# EAGLE design 5d (EAGLE 6.4)
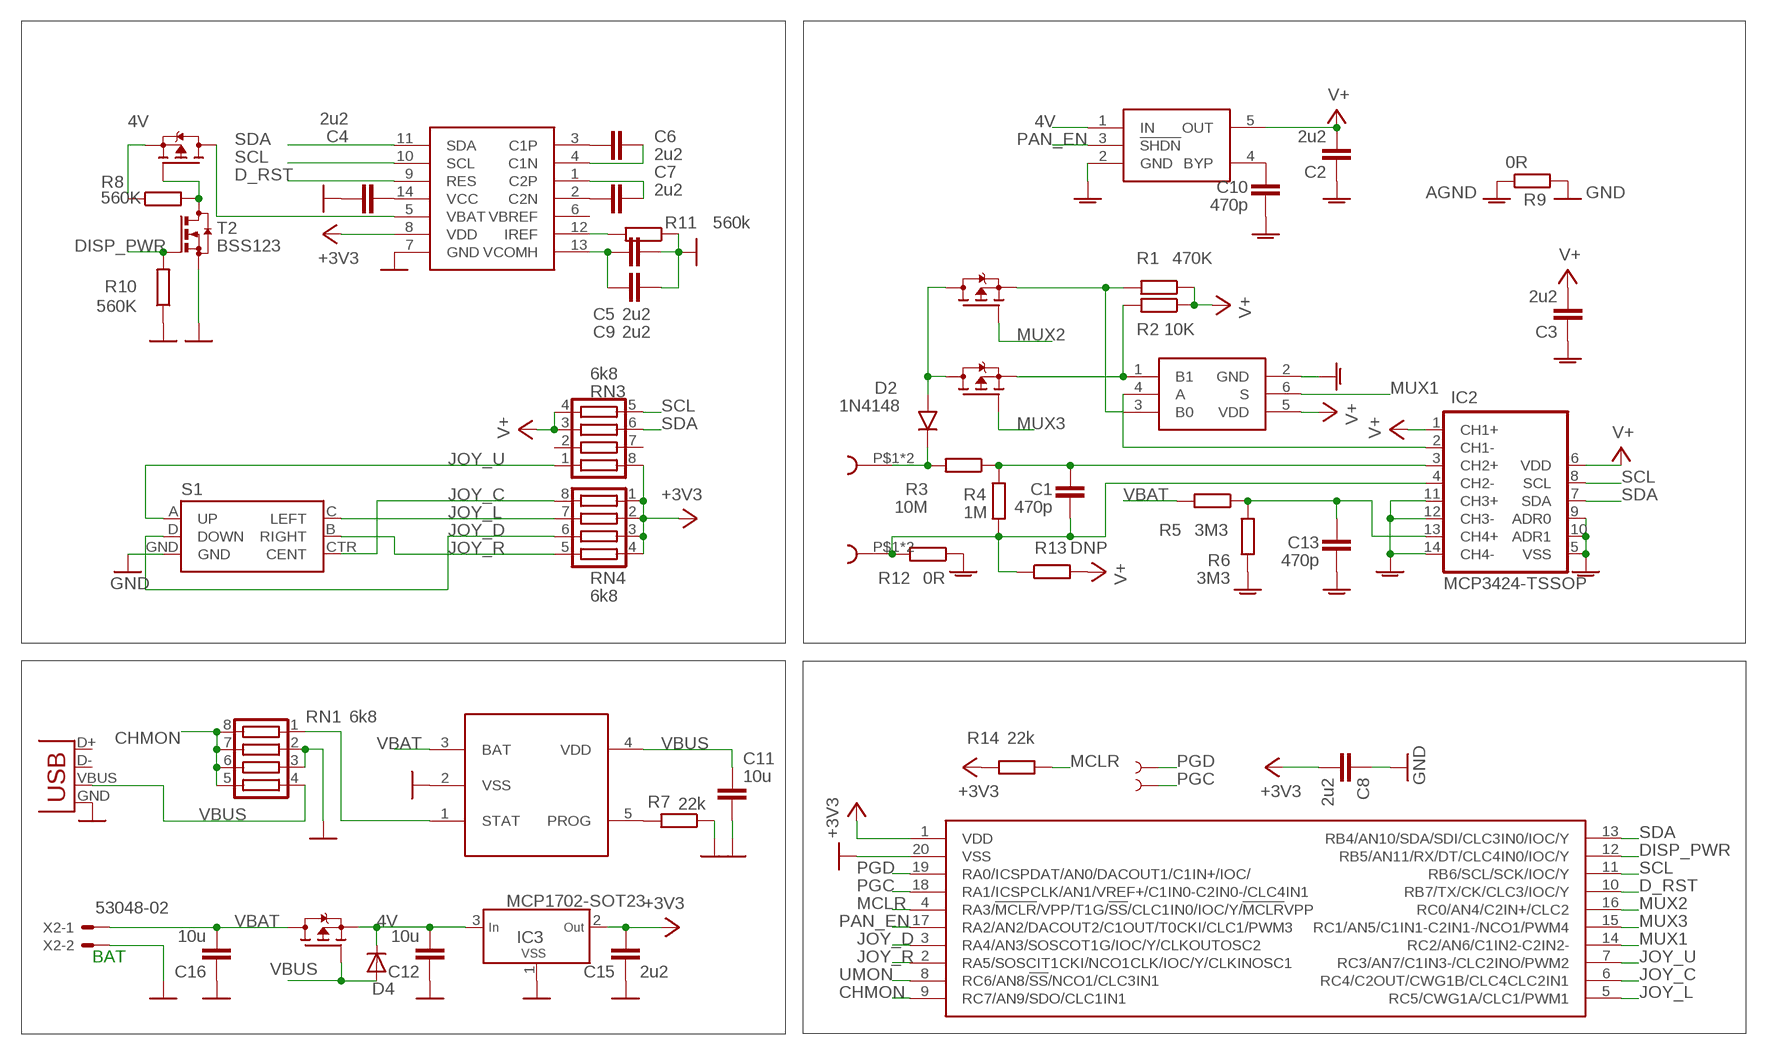
[diagram p0: schematic, sheet 1]

## Parts
C1  470p  C_0603  [0603]
C2  2u2  C_0603  [0603]
C3  2u2  C_0603  [0603]
C4  2u2  C_0603  [0603]
C5  2u2  C_0603  [0603]
C6  2u2  C_0603  [0603]
C7  2u2  C_0603  [0603]
C8  2u2  C_0603  [0603]
C9  2u2  C_0603  [0603]
C10  470p  C_0603  [0603]
C11  10u  C_0806  [R0805]
C12  10u  C_0806  [R0805]
C13  470p  C_0603  [0603]
C15  2u2  C_0603  [0603]
C16  10u  C_0806  [R0805]
D1  DISP_OLED_049B  [DISP_OLED_049_B]
D2  1N4148  1N4148SOD  [SOD-80]
D4  DIODE-SOD123  [SOD123]
IC2  MCP3424-TSSOP  [TSSOP14]
IC3  MCP1702-SOT23  [SOT23]
IC5  NC7SB3157  [SC70-6]
R1  470K  R_0805  [R0805]
R2  10K  R_0805  [R0805]
R3  10M  R_0805  [R0805]
R4  1M  R_0805  [R0805]
R5  3M3  R_0603  [0603]
R6  3M3  R_0603  [0603]
R7  22k  R_0603  [0603]
R8  560K  R_0603  [0603]
R9  0R  R_0603  [0603]
R10  560K  R_0603  [0603]
R11  560k  R_0603  [0603]
R12  0R  R_0603  [0603]
R13  DNP  R_0603  [0603]
R14  22k  R_0603  [0603]
RN1  6k8  CTS742C083  [CTS742C083]
RN3  6k8  CTS742C083  [CTS742C083]
RN4  6k8  CTS742C083  [CTS742C083]
S1  JOYSTICK_MINI  [JOYSTICK_MINI]
T1  BSS84  [SOT23-3]
T2  BSS123  [SOT23]
T3  BSS84  [SOT23-3]
T4  BSS84  [SOT23-3]
T5  BSS84  [SOT23-3]
TP1  TEST-POINT3X5  [PAD.03X.05]
TP2  TEST-POINT3X5  [PAD.03X.05]
U$1  BANPLUG_2  [BANPLUG_2]
U$2  BANPLUG_2  [BANPLUG_2]
U$3  TC1015  [SOT23-5]
U$4  MCP73831  [SOT23-5]
U$6  PIC16F1508SSOP20  [SSOP20]
X1  USB-MICROB  [USB-MICROB]
X2  53048-02  [53048-02]

## Nets
4V: C12.2 D4.C IC3.3(IN) R8.1 T1.2(S) T3.2(S) U$3.1(IN)
+3V3: C8.2 C15.2 D1.8(VDD) IC3.2(OUT) R14.2 RN3.8 RN4.1 RN4.2 RN4.3 RN4.4 U$6.1(VDD)
AGND: C2.1 C3.1 C10.1 C13.1 IC2.5(VSS) IC2.9(ADR0) IC2.10(ADR1) IC2.11(CH3+) IC2.12(CH3-) IC2.14(CH4-) IC5.2(GND) R6.2 R9.1 R12.1 U$3.2(GND)
CHMON: RN1.5 RN1.6 RN1.7 RN1.8 U$6.9(RC7/AN9/SDO/CLC1IN1)
D_RST: D1.9(RES) U$6.10(RB7/TX/CK/CLC3/IOC/Y)
DISP_PWR: R10.2 T2.1(G) U$6.12(RB5/AN11/RX/DT/CLC4IN0/IOC/Y)
GND: C4.1 C5.2 C8.1 C9.2 C11.2 C12.1 C15.1 C16.1 D1.7(GND) IC3.1(VSS) R7.1 R9.2 R10.1 R11.1 RN1.2 RN1.3 S1.GND T2.2(S) U$4.2(VSS) U$6.20(VSS) X1.GND X2.2
JOY_C: RN4.8 S1.CTR(CENT) U$6.6(RC4/C2OUT/CWG1B/CLC4CLC2IN1)
JOY_D: RN4.6 S1.D(DOWN) U$6.3(RA4/AN3/SOSCOT1G/IOC/Y/CLKOUTOSC2)
JOY_L: RN4.7 S1.C(LEFT) U$6.5(RC5/CWG1A/CLC1/PWM1)
JOY_R: RN4.5 S1.B(RIGHT) U$6.2(RA5/SOSCIT1CKI/NCO1CLK/IOC/Y/CLKINOSC1)
JOY_U: RN3.1 S1.A(UP) U$6.7(RC3/AN7/C1IN3-/CLC2INO/PWM2)
MCLR: R14.1 U$6.4(RA3/!MCLR!/VPP/T1G/!SS!/CLC1IN0/IOC/Y/!MCLR!VPP)
MUX1: IC5.6(S) U$6.14(RC2/AN6/C1IN2-C2IN2-)
MUX2: T4.1(G) U$6.16(RC0/AN4/C2IN+/CLC2)
MUX3: T5.1(G) U$6.15(RC1/AN5/C1IN1-C2IN1-/NCO1/PWM4)
N$1: C10.2 U$3.4(BYP)
N$2: IC5.1(B1) R2.2 T5.2(S)
N$3: IC5.3(B0) R1.2 T4.2(S)
N$4: C13.2 IC2.13(CH4+) R5.1 R6.1
N$5: IC2.2(CH1-) IC5.4(A)
N$6: D2.K R3.2 U$1.P$1 U$1.P$2
N$7: R8.2 T2.3(D) T3.1(G)
N$8: C1.2 IC2.3(CH2+) R3.1 R4.1
N$9: RN1.1 U$4.1(STAT)
N$10: C1.1 IC2.4(CH2-) R4.2 R12.2 R13.1 U$2.P$1 U$2.P$2
N$11: C4.2 D1.14(VCC)
N$12: D1.5(VBAT) T3.3(D)
N$13: C5.1 C9.1 D1.13(VCOMH)
N$14: D1.12(IREF) R11.2
N$15: D2.A T4.3(D) T5.3(D)
N$18: C6.1 D1.3(C1P)
N$19: C7.1 D1.2(C2N)
N$20: C7.2 D1.1(C2P)
N$21: C6.2 D1.4(C1N)
N$78: R7.2 U$4.5(PROG)
PAN_EN: U$3.3(!SHDN) U$6.17(RA2/AN2/DACOUT2/C1OUT/T0CKI/CLC1/PWM3)
PGC: TP2.P$1 U$6.18(RA1/ICSPCLK/AN1/VREF+/C1IN0-C2IN0-/CLC4IN1)
PGD: TP1.P$1 U$6.19(RA0/ICSPDAT/AN0/DACOUT1/C1IN+/IOC/)
SCL: D1.10(SCL) IC2.8(SCL) RN3.5 U$6.11(RB6/SCL/SCK/IOC/Y)
SDA: D1.11(SDA) IC2.7(SDA) RN3.6 U$6.13(RB4/AN10/SDA/SDI/CLC3IN0/IOC/Y)
UMON: U$6.8(RC6/AN8/!SS!/NCO1/CLC3IN1)
V+: C2.2 C3.2 IC2.1(CH1+) IC2.6(VDD) IC5.5(VDD) R1.1 R2.1 R13.2 RN3.3 RN3.4 U$3.5(OUT)
VBAT: C16.2 R5.2 T1.3(D) U$4.3(BAT) X2.1
VBUS: C11.1 D4.A RN1.4 T1.1(G) U$4.4(VDD) X1.VBUS
Unconnected: D1.6(VBREF) RN3.2 RN3.7 X1.D+ X1.D-

## Notes on the sheet
- BAT

## Library data of the parts
C1-C13 C15 C16 = _moja:C
D1 = _moja:DISP_OLED_049
D2 = _mcom5:1N4148
D4 = diode:DIODE-: DIODE
IC2 = _mcom5:MCP3424
IC3 = _mcom4:MCP1702
IC5 = _mcom5:NC7SB3157
R1-R14 = _moja:R
RN1 RN3 RN4 = resistor-net:CTS742C083: Chip Resistor Array 4 Single Resistor Source: http://www.ctscorp.com/components/Datasheets/CTSChipArrayDs.pdf
S1 = SparkFun-Electromechanical:JOYSTICK_MINI: Small 5-way tactile joystick, COM-10063 4UCON SF303GJ26
T1 T3-T5 = _moja:BSS84
T2 = transistor-small-signal:BSS123: N-CHANNEL MOS FET
TP1 TP2 = SparkFun:TEST-POINT
U$1 U$2 = _moja:BANPLUG_2
U$3 = _moja:TC1015
U$4 = _moja:MCP73831
U$6 = _mcom5:PIC16F1508
X1 = SparkFun:USB: USB Connectors USB-B-PTH is fully proven SKU : PRT-00139 USB-miniB is fully proven SKU : PRT-00587 USB-A-PCB is untested. USB-A-H is throughly reviewed, but untested. Spark Fun Electronics SKU : PRT-00437 USB-B-SMT is throughly reviewed, but untested. Needs silkscreen touching up. USB-A-S has not been used/tested USB-MB-H has not been used/tested
X2 = con-molex:53?-02: CONNECTOR wire to board 1.25 mm (.049 inch) pitch header

## Board
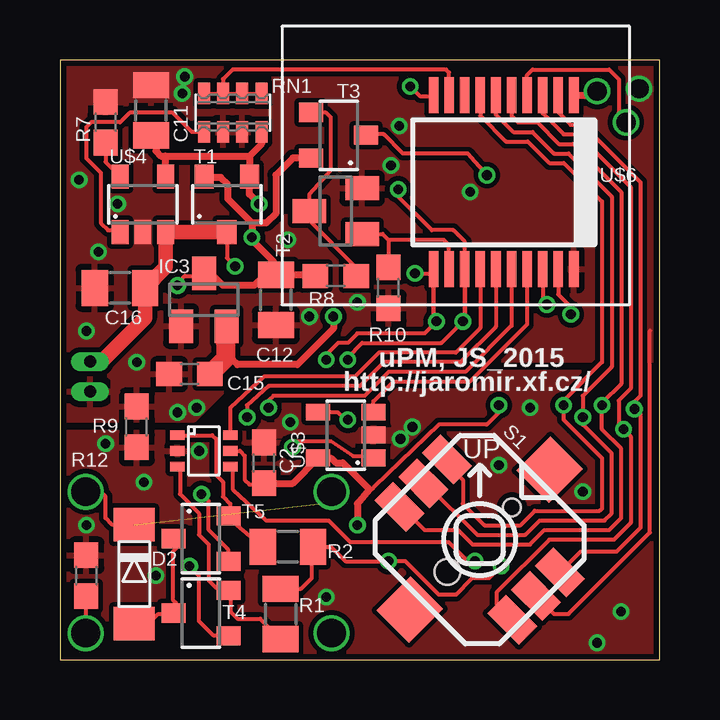
[diagram p1: board, top side]
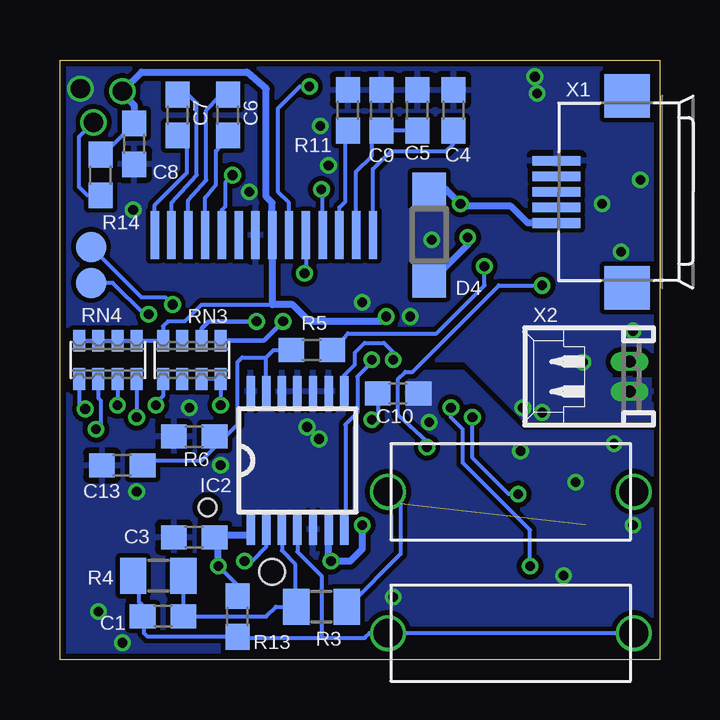
[diagram p2: board, bottom side, seen from below]

Size 25 x 25 mm. Coordinates in mm from the lower left corner, seen from the top.
Outline: 0,0 25,0 25,25 0,25 0,0
Copper layers (1*16): Top 0.035mm / dielectric 1.5mm / Bottom 0.035mm
Design rules "ch_6": minimum track width 0.15mm, minimum drill 0.4mm, track to track 0.2mm, track to pad 0.2mm, pad to pad 0.2mm, via to via 0.2mm, smd to smd 0.2mm, copper to edge 10mil, drill to drill 8mil, minimum pad ring 0.15mm, minimum via ring 0.15mm, stop-mask expansion 4mil, vias tented up to drill 0mil, thermal gap 10mil

### Footprints (pad centres in the part's own frame; a part is rotated, then mirrored left to right if it is on the bottom)
0603 = smd 1.067 x 1: 1 -0.85,0; 2 0.85,0
R0805 = smd 1.1 x 1.5: 1 -1.05,0; 2 1.05,0
DISP_OLED_049_B = smd 0.35 x 2 bottom: 1 4.55,-2.9; 2 3.85,-2.9; 3 3.15,-2.9; 4 2.45,-2.9; 5 1.75,-2.9; 6 1.05,-2.9; 7 0.35,-2.9; 8 -0.35,-2.9; 9 -1.05,-2.9; 10 -1.75,-2.9; 11 -2.45,-2.9; 12 -3.15,-2.9; 13 -3.85,-2.9; 14 -4.55,-2.9
SOD-80 = smd 1.397 x 1.702: A 1.905,0; K -2.223,0
SOD123 = smd 1.4 x 1.4: A 1.9,0; C -1.9,0
TSSOP14 = smd 1.3 x 0.35: 1 -2.875,1.95; 2 -2.875,1.3; 3 -2.875,0.65; 4 -2.875,0; 5 -2.875,-0.65; 6 -2.875,-1.3; 7 -2.875,-1.95; 8 2.875,-1.95; 9 2.875,-1.3; 10 2.875,-0.65; 11 2.875,0; 12 2.875,0.65; 13 2.875,1.3; 14 2.875,1.95
SOT23 = smd 1 x 1.4: 1 -0.95,-1.1; 2 0.95,-1.1; 3 0,1.1
SC70-6 = smd 0.4 x 0.6: 1 -0.65,-1.1; 2 0,-1.1; 3 0.65,-1.1; 4 0.65,1.1; 5 0,1.1; 6 -0.65,1.1
CTS742C083 = smd 0.5 x 0.9: 1 -1.2,-0.8; 2 -0.4,-0.8; 3 0.4,-0.8; 4 1.2,-0.8; 5 1.2,0.8; 6 0.4,0.8; 7 -0.4,0.8; 8 -1.2,0.8
JOYSTICK_MINI = smd 1.85 x 1.1: A -3.325,1.4; B 3.325,1.4; C -3.325,-1.4; CTR -3.325,0; D 3.325,-1.4; GND 3.325,0 | smd 1.9 x 2: NC 0,4.13; NC@0 0,-4.13 | hole 0.75: 0,1.9 | hole 1.05: 0,-1.9
SOT23-3 = smd 0.8 x 1: 1 0.91,1.13; 2 -0.99,1.13; 3 -0.04,-1.17
PAD.03X.05 = smd 1.27 x 1.27: P$1 0,0
BANPLUG_2 = drill 1.2: P$1 -5.125,0; P$2 5.125,0
SOT23-5 = smd 0.7 x 1: 1 -0.99,-1.17; 2 -0.04,-1.17; 3 0.91,-1.17; 4 0.91,1.13; 5 -0.99,1.13
SSOP20 = smd 0.4 x 1.5: 1 -2.925,-3.625; 2 -2.275,-3.625; 3 -1.625,-3.625; 4 -0.975,-3.625; 5 -0.325,-3.625; 6 0.325,-3.625; 7 0.975,-3.625; 8 1.625,-3.625; 9 2.275,-3.625; 10 2.925,-3.625; 11 2.925,3.625; 12 2.275,3.625; 13 1.625,3.625; 14 0.975,3.625; 15 0.325,3.625; 16 -0.325,3.625; 17 -0.975,3.625; 18 -1.625,3.625; 19 -2.275,3.625; 20 -2.925,3.625
USB-MICROB = smd 0.4 x 2: D+ 0,3.1; D- -0.65,3.1; GND 1.3,3.1; ID 0.65,3.1; VBUS -1.3,3.1 | smd 1.8 x 1.9: GND@2 -4,0.15; GND@3 4,0.15
53048-02 = drill 0.5 pad 0.698 long: 1 0.625,-1.25; 2 -0.625,-1.25

### Placement (x,y rotation side)
C1  20.7,1.8 0 bottom
C2  8.5,8.2 270 top
C3  19.4,5.1 0 bottom
C4  8.6,22.9 270 bottom
C5  10.1,22.9 90 bottom
C6  18,22.7 270 bottom
C7  20.1,22.7 270 bottom
C8  21.9,21.5 90 bottom
C9  11.6,22.9 90 bottom
C10  10.9,11.1 180 bottom
C11  3.8,22.9 90 top
C12  9,15 90 top
C13  22.4,8.1 0 bottom
C15  5.4,11.9 0 top
C16  2.5,15.5 0 top
D1  16.5,20.6 0 top
D2  3.1,3.4 270 top
D4  9.6,17.7 90 bottom
IC2  15.1,8.3 90 bottom
IC3  6,15 0 top
IC5  6,8.7 270 top
R1  9.2,1.9 270 top
R2  9.5,4.7 180 top
R3  14.1,2.2 0 bottom
R4  20.9,3.5 180 bottom
R5  14.5,12.9 0 bottom
R6  19.4,9.3 180 bottom
R7  1.9,22.4 270 top
R8  11.5,16 0 top
R9  3.2,9.7 90 top
R10  13.7,15.5 90 top
R11  13,22.9 270 bottom
R12  1.1,3.5 270 top
R13  17.6,1.8 90 bottom
R14  23.3,20.2 90 bottom
RN1  7.2,22.8 0 top
RN3  19.5,12.5 0 bottom
RN4  23,12.5 180 bottom
S1  17.5,5 315 top
T1  7,19 0 top
T2  11.5,18.7 90 top
T3  11.6,21.9 90 top
T4  5.9,1.9 270 top
T5  5.9,5 270 top
TP1  23.7,15.7 0 bottom
TP2  23.7,17.2 0 bottom
U$1  6.2,7 180 bottom
U$2  6.2,1.1 0 bottom
U$3  11.9,9.4 90 top
U$4  3.5,19 0 top
U$6  18.5,19.9 180 top
X1  1.2,19.5 90 bottom
X2  2.5,11.8 90 bottom

### Tracks (layer width: path | path; a pad name or v marks a point on that pad's centre or on a via)
4V  (via drill 0.4)
  Top 0.16: U$3.1 12.87,8.47 12.23,8.47 11.3,9.1 9.9,9.1 v9.7,8.85 | v4.9,15.6 4.9,15.7 5.2,16 5.9,16 IC3.3
  Top 0.3: 8,18.2 v8,17.6 8,17.5 8.9,16.6 8.9,16.15 C12.2 | IC3.3 6.1,16 6.4,16 6.8,15.6 8.1,15.6 8.5,16 8.95,16 C12.2 | C12.2 10.2,16.05 R8.1 | T3.2 9.71,20.91 9,20.2 9,18.6 8.6,18.2 8,18.2 | 8,18.2 7,19.2 7,19.8 6.7,20.1 6.04,20.1 T1.2
  Bottom 0.16: v9.7,8.85 9.7,9.1 10.9,10.2 10.9,11.7 10.6,12 10.3,12 6.7,15.6 v4.9,15.6
  Bottom 0.3: D4.C 9.5,15.8 8,17.3 v8,17.6
+3V3  (via drill 0.4, 0.8)
  Top 0.3: 6.95,13.8 IC3.2 | U$6.1 22.23,23.52 v22.4,23.7 | v11.4,14.3 11.4,13.8 9.9,12.3 7.4,12.3 7.2,12.5 7.05,12.7 6.9,12.55
  Top 0.8: 6.95,13.8 6.95,13.45 6.9,13.2 6.9,12.55 C15.2
  Bottom 0.16: RN4.4 RN4.3 RN4.2 RN4.1 RN3.8 20.7,13.9 20.5,14.1 19.8,14.1 19.1,14.8 16.15,14.8 | R14.2 23.2,21.05 C8.2
  Bottom 0.3: v11.4,14.3 11.6,14.1 14.6,14.1 15.3,14.8 16.15,14.8 D1.8 16.15,19.05 16.4,19.3 16.4,23.8 17.2,24.5 21.6,24.5 v22.4,23.7 21.9,23.1 C8.2
AGND  (via drill 0.4)
  other vias: 14.2,9.2 22.4,0.7 21.8,7 1.9,9 23.4,2 5.8,8.7 9.6,9.9 14.7,9.7 18.3,8.1 19.6,10.5 1.1,5.6 4,3.5 11.1,2.6 3.5,7.4
  pour Top: 0,0 25,0 25,12 9,12 6.5,9.5 0,9.5
  pour Bottom: 0,0 25,0 25,12 8.2,12 5.7,9.5 0,9.5
  pour Top (no thermals): 8.4,9.8 8.1,9.3 9.2,9.3 9.4,9.5 9.4,9.8
  pour Bottom (no thermals): 10.4,10.2 10.5,10.3 10.5,12 9.2,12 9.2,10.2
  pour Top (no thermals): 12.5,9.6 12.1,9.1 13.9,9.1 13.9,9.6
CHMON
  Top 0.16: RN1.7 6.8,24.2 7.2,24.6 16.1,24.6 16.23,24.48 U$6.9 | RN1.8 RN1.7 | RN1.7 RN1.6 RN1.5
D_RST  (via drill 0.4)
  Top 0.16: v14.6,23.9 15,23.5 15.55,23.5 U$6.10
  Bottom 0.16: v14.6,23.9 15,23.9 15.9,23 15.9,19.5 15.45,19.05 D1.9
DISP_PWR
  Top 0.16: U$6.12 16.23,17.27 16,17.5 13.7,17.5 | 13.7,17.5 R10.2 | T2.1 13.45,17.75 13.7,17.5
GND  (via drill 0.4, 0.8)
  Top 0.16: S1.GND 19.95,2.65 19.95,2.55 20.6,1.9 21.2,1.9 24.6,5.3 24.6,13.7
  other vias: 5.7,10.5 1.6,17 24.15,23.8 9.5,17.5 10.4,14.3 0.8,20 13.8,20.6 5.2,24.3 1.1,13.7 3.2,12.4 4.9,10.3 14.15,22.25 5.1,23.6 2.4,19 21.95,18.75 17.1,19.5 12.4,14.9
  pour Top: 0,10 5.6,10 8.1,12.5 25,12.5 25,25 0,25
  pour Bottom: 0,10 5.6,10 8.1,12.5 25,12.5 25,25 0,25
  pour Bottom (no thermals): 0.4,10.5 2.4,10.5 2.4,11.7 0.4,11.7
  pour Top (no thermals): 1,23.3 5.1,23.3 5.1,24.7 1,24.7
  pour Top (no thermals): 4.4,16.8 4.4,18.8 1.8,18.8 1.8,16.8
  pour Top (no thermals): 2.3,11.8 2.3,10.6 2.2,10.6 2.2,11.1 1.8,11.1 1.8,11.2 2.2,11.2 2.2,11.8
JOY_C  (via drill 0.4)
  Top 0.16: U$6.6 18.18,22.73 18.9,22 19.7,22 20.6,21.1 21.2,21.1 23,19.3 23,12.2 21.8,11 v21.8,10.1 21.8,9.8 23,8.6 23,6.1 22.7,5.8 20,5.8 19.4,5.2 17.4,5.2 15.25,7.35 S1.CTR
  Bottom 0.16: RN4.8 v21.8,10.1
JOY_D  (via drill 0.4)
  Top 0.16: S1.D 18.2,2.32 18.2,2.8 20.4,5 23.1,5 23.8,5.7 23.8,9.3 v23.5,9.6 23.3,9.8 23.3,10.8 23.8,11.3 23.8,19.7 21.6,21.9 21,21.9 20.12,22.77 U$6.3
  Bottom 0.16: RN4.6 23.4,10.9 23.3,10.8 23.3,9.8 v23.5,9.6
JOY_L  (via drill 0.4)
  Top 0.16: U$6.5 18.82,22.68 19.1,22.4 19.9,22.4 20.8,21.5 21.4,21.5 23.4,19.5 23.4,11.5 22.6,10.7 v22.6,10.6 22.6,9.6 23.4,8.8 23.4,5.9 22.9,5.4 20.2,5.4 19.6,4.8 17.2,4.8 16.6,5.4 15.2,5.4 14.34,6.26 14.34,6.36 S1.C
  Bottom 0.16: RN4.7 v22.6,10.6
JOY_R  (via drill 0.4)
  Top 0.16: U$6.2 20.77,22.82 21.3,22.3 21.8,22.3 24.2,19.9 24.2,11 23.9,10.7 23.9,10.5 v23.95,10.45 24.2,10.2 24.2,5.5 23.2,4.5 21.7,4.5 S1.B
  Bottom 0.16: RN4.5 24.2,10.4 v23.95,10.45
JOY_U  (via drill 0.4)
  Top 0.16: U$6.7 17.52,22.68 18.6,21.6 19.5,21.6 20.4,20.7 21,20.7 22.6,19.1 22.6,12.4 21,10.8 v21,10.6 21,10 22.6,8.4 22.6,6.3 22.5,6.2 19.8,6.2 19.2,5.6 17.7,5.6 16.8,6.5 16.8,7.5 16.14,8.16 S1.A
  Bottom 0.16: RN3.1 20.7,11 21,10.7 v21,10.6
MCLR  (via drill 0.8)
  Top 0.16: U$6.4 19.48,24.38 19.7,24.6 22.9,24.6 23.3,24.2 23.3,22.8 v23.6,22.4
  Bottom 0.16: R14.1 23.85,19.35 24.2,19.7 24.2,21.8 v23.6,22.4
MUX1
  Top 0.16: U$6.14 17.52,13.82 16.5,12.8 13.3,12.8 12.3,11.8 8.5,11.8 7.1,10.5 IC5.6
MUX2  (via drill 0.4)
  Top 0.16: U$6.16 18.82,13.93 16.9,12 13.7,12 12.7,11 8.9,11 8.7,10.8 v8.7,10.5 | T4.1 6.41,0.99 5.8,1.6 5.8,3.5 v5.4,3.9
  Bottom 0.16: v8.7,10.5 8.7,10.1 8.2,9.6 8.2,8.2 5.4,5.4 v5.4,3.9
MUX3  (via drill 0.4)
  Top 0.16: U$6.15 18.18,13.88 16.7,12.4 13.5,12.4 12.5,11.4 8.7,11.4 7.8,10.6 v7.8,10.1 | T5.1 7.03,4.57 6.2,5.4 6.2,6.6 v5.9,6.9
  Bottom 0.16: v7.8,10.1 7.8,8.4 6.3,6.9 v5.9,6.9
N$1  (via drill 0.4)
  Top 0.16: v12,10 11.9,10 11.6,10.3 U$3.4
  Bottom 0.16: C10.2 11.75,10.25 v12,10
N$2
  Top 0.16: IC5.1 6.35,9.35 6.5,9.2 6.5,7.7 6.8,7.4 6.8,6.8 7.1,6.5 7.1,6.02 | 7.1,6.02 T5.2 | 7.1,6.02 7.1,5.85 R2.2
N$3
  Top 0.16: IC5.3 5,7.95 5,6.9 5.8,6.1 5.8,5.2 6.2,4.8 6.2,3.3 6.5,3 7.02,3 T4.2 7.12,2.9 7.12,1.98 7.4,1.7 8.35,1.7 R1.2
N$4
  Bottom 0.16: IC2.13 16.4,12.6 | 16.4,12.6 16.1,12.9 R5.1 | 16.4,12.6 17.4,12.6 17.6,12.4 17.6,9.8 18.15,9.25 R6.1 18.4,9.25 18.4,9 19.1,8.3 21.4,8.3 C13.2
N$5  (via drill 0.4)
  Top 0.16: v17.3,4.1 17,4.1 16.2,4.9 12.1,4.9 11.2,5.8 8.6,5.8 7.2,7.1 7.2,8 7.15,8.05 IC5.4
  Bottom 0.16: IC2.2 16.4,4.7 17,4.1 v17.3,4.1
N$6  (1 unrouted)
  Top 0.16: D2.K 2.18,5.62 1.9,5.9 1.9,6.8 1.7,7 U$1.P$1
  Bottom 0.16: U$1.P$2 11.3,7 10.8,6.5 10.8,4.4 13,2.2 13,2.25 R3.2
N$7
  Top 0.16: R8.2 12.35,16.35 10.4,18.3 T2.3 10.4,19.4 11.3,20.4 11.3,22.6 11.1,22.8 T3.1
N$8
  Bottom 0.16: IC2.3 15.75,4.55 15.2,4 15.2,2.25 R3.1 | 19.5,3.2 19.6,3.3 R4.1 C1.2 16.4,1.8 16,2.2 R3.1 | 15.1,2.15 R3.1
N$9
  Top 0.16: RN1.1 5.5,22 4.7,22.8 2.9,22.8 2.5,22.4 1.3,22.4 1.1,22.2 1.1,20.9 1.7,20.3 1.7,18.2 2,17.9 2.3,17.9 U$4.1
N$10
  Top 0.16: R12.2 1.07,2.65 U$2.P$2
  Bottom 0.16: IC2.4 15.1,4.5 14.1,3.5 14.1,0.9 | 14.1,0.9 12.3,0.9 12.1,1.1 U$2.P$1 U$2.P$2 | R4.2 21.7,3.25 21.7,2.4 21.35,2.05 C1.1 21.5,1.75 21.5,1.1 21.35,0.95 R13.1 17.25,0.95 17.2,0.9 14.1,0.9
N$11
  Bottom 0.16: D1.14 11.95,20.45 11.2,21.2 8.9,21.2 8.6,21.5 C4.2
N$12  (via drill 0.4)
  Top 0.16: v17.8,20.2 17,21.1 14.3,21.1 13.5,21.9 12.81,21.9 T3.3
  Bottom 0.16: D1.5 18.25,18.75 18.1,18.9 18.1,19.9 v17.8,20.2
N$13
  Bottom 0.16: D1.13 12.65,20.35 12,21 12,21.65 C9.1 C5.1
N$14
  Bottom 0.16: D1.12 13.35,18.85 13.1,19.1 13.1,21.6 13,21.7 R11.2
N$15
  Top 0.16: T5.3 4.83,4.63 4.7,4.5 4.7,2.5 4.83,2.37 T4.3 4.79,1.9 4.1,1.9 3.69,1.5 D2.A
N$18
  Bottom 0.16: D1.3 19.65,19.15 18.9,20 18.9,22.9 18.35,23.5 C6.1
N$19
  Bottom 0.16: D1.2 20.35,19.05 19.3,20.2 19.3,23.2 19.6,23.5 20.15,23.5 C7.1
N$20
  Bottom 0.16: D1.1 21.05,18.95 19.7,20.3 19.7,21.3 20.1,21.7 C7.2
N$21
  Bottom 0.16: D1.4 18.95,19.25 18.5,19.8 18.5,21.2 18.3,21.4 C6.2
N$78
  Top 0.16: R7.2 1.9,20.74 U$4.5
PAN_EN
  Top 0.16: U$3.3 13.07,10.77 13.9,11.6 17.1,11.6 19.48,13.97 U$6.17
PGC  (via drill 0.4)
  Top 0.16: U$6.18 20.12,14.93 v20.3,14.8
  Bottom 0.16: v20.3,14.8 20.6,15.1 21.6,15.1 TP2.P$1
PGD  (via drill 0.4)
  Top 0.16: U$6.19 20.77,15.22 21.3,14.7 v21.3,14.4
  Bottom 0.16: v21.3,14.4 21.5,14.4 22.8,15.7 TP1.P$1
SCL  (via drill 0.4)
  Top 0.16: 15.57,14.12 15.57,13.97 15.2,13.6 12.4,13.6 12,13.2 11.6,13.2 11.1,12.7 v11.1,12.5 | v14.8,16.1 15.4,16.1 U$6.11
  Top 0.18: 15.6,14.1 v15.7,14.1 15.57,14.12 U$6.11
  Bottom 0.16: v14.8,16.1 14.75,16.25 D1.10 | IC2.8 13.15,11.85 12.7,12.3 12.7,12.8 12.3,13.2 11.5,13.2 11.1,12.8 v11.1,12.5
  Bottom 0.18: RN3.5 16.5,13.3 v15.7,14.1
SDA  (via drill 0.4)
  Top 0.16: U$6.13 16.88,17.43 16.4,17.9 15.5,17.9 14.1,19.3 v14.1,19.6 | v12,12.5 12,12.6 12.6,13.2 15.9,13.2 v16.8,14.1
  Top 0.18: U$6.13 16.88,14.18 v16.8,14.1
  Bottom 0.16: v12,12.5 12,12.4 12.6,11.8 12.6,10.3 13.1,9.8 13.1,5.28 IC2.7 | D1.11 14.05,19.55 v14.1,19.6
  Bottom 0.18: RN3.6 19.1,13.8 18.8,14.1 v16.8,14.1
V+  (via drill 0.4)
  Top 0.16: 11.16,8.4 U$3.5 11.1,8.34 10.69,8.34 | v18.4,3.9 17.9,3.4 17.2,3.4 16.5,2.7 15.8,2.7 14.4,4.1 v13.7,4.1 11.9,4.1 11.3,4.7 R2.1 10.5,4.45 10.5,3.4 10.05,2.95 R1.1 | v18.3,10.6 18.3,10.3 17.8,9.8 15.8,9.8 13.1,7.2 13,7.1 12.9,7.1 | IC5.5 7.5,8.7 7.7,8.5 7.7,7.5 7.9,7.3 8.45,7.3 C2.2
  Top 0.3: v12.4,5.6 12.4,6.5 12.9,7.1 11.8,8.2 11.5,8.2 11.3,8.4 11.16,8.4 | C2.2 9.71,7.35 U$3.5
  Bottom 0.16: 18.35,5.15 C3.2 18.4,4.95 | 17.07,5.2 IC2.1 | v18.3,10.6 RN3.4 RN3.3 | R13.2 17.6,3.1 v18.4,3.9
  Bottom 0.3: 18.35,5.15 18.3,5.2 17.07,5.2 | IC2.6 13.8,4.2 v13.7,4.1 12.9,4.1 12.4,4.6 v12.4,5.6 | v18.4,3.9 18.4,4.95
VBAT  (via drill 0.4)
  Top 0.16: T1.3 6.96,16.74 v7.3,16.4
  Top 0.6: T1.3 U$4.3 4.41,16.36 C16.2 3.55,14.24 1.74,12.43 X2.1
  Bottom 0.16: R5.2 13.7,12.8 13,13.6 9.3,13.6 7.3,15.6 v7.3,16.4
VBUS  (via drill 0.4)
  Top 0.3: 4.43,20.13 U$4.4 4.41,20.31 4.4,20.5 4.4,21 | v8.3,19 7.9,19.4 T1.1 7.9,21 | 4.4,21 7.9,21 | RN1.4 8.4,21.5 7.9,21 | C11.1 3.95,21.85 4,21.7 4,21.2 4.2,21 4.4,21
  Bottom 0.3: X1.VBUS 5.5,18.2 6.2,18.9 8.3,18.9 v8.3,19 8.9,19.6 D4.A

### Text on the board
tNames: uPM, JS_2015 | http://jaromir.xf.cz/